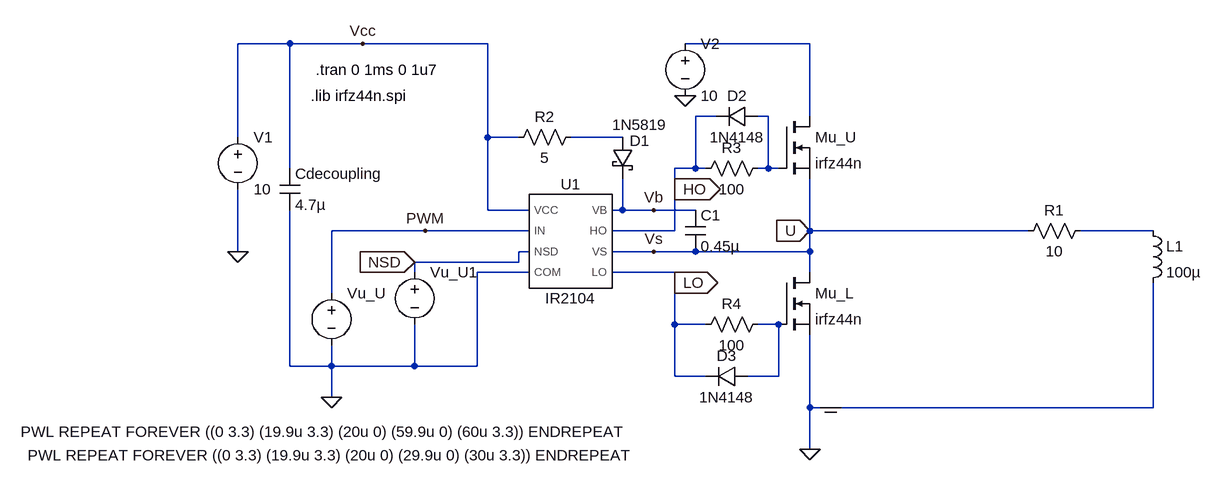
[diagram p0: schematic single_bldc_driver.asc]
single_bldc_driver.asc, the LTspice schematic file:
Version 4
SHEET 1 2100 1880
WIRE -1200 -608 -1280 -608
WIRE -1088 -608 -1200 -608
WIRE -896 -608 -1088 -608
WIRE -400 -608 -592 -608
WIRE -544 -496 -576 -496
WIRE -464 -496 -480 -496
WIRE -400 -496 -400 -608
WIRE -1280 -464 -1280 -608
WIRE -896 -464 -896 -608
WIRE -848 -464 -896 -464
WIRE -688 -464 -768 -464
WIRE -1200 -416 -1200 -608
WIRE -576 -416 -576 -496
WIRE -576 -416 -608 -416
WIRE -560 -416 -576 -416
WIRE -464 -416 -464 -496
WIRE -464 -416 -480 -416
WIRE -448 -416 -464 -416
WIRE -608 -384 -608 -416
WIRE -896 -352 -896 -464
WIRE -832 -352 -896 -352
WIRE -688 -352 -688 -400
WIRE -688 -352 -704 -352
WIRE -640 -352 -688 -352
WIRE -576 -352 -640 -352
WIRE -992 -320 -1136 -320
WIRE -832 -320 -992 -320
WIRE -608 -320 -608 -384
WIRE -608 -320 -704 -320
WIRE -400 -320 -400 -400
WIRE -64 -320 -400 -320
WIRE 128 -320 16 -320
WIRE -1280 -288 -1280 -384
WIRE -832 -288 -848 -288
WIRE -640 -288 -704 -288
WIRE -576 -288 -640 -288
WIRE -400 -288 -400 -320
WIRE -400 -288 -576 -288
WIRE -848 -272 -848 -288
WIRE -848 -272 -1008 -272
WIRE -1008 -256 -1008 -272
WIRE -832 -256 -912 -256
WIRE -608 -256 -704 -256
WIRE -400 -256 -400 -288
WIRE -608 -240 -608 -256
WIRE -1136 -224 -1136 -320
WIRE -608 -176 -608 -240
WIRE -560 -176 -608 -176
WIRE -448 -176 -480 -176
WIRE -1200 -112 -1200 -352
WIRE -1136 -112 -1136 -144
WIRE -1136 -112 -1200 -112
WIRE -1008 -112 -1008 -176
WIRE -1008 -112 -1136 -112
WIRE -912 -112 -912 -256
WIRE -912 -112 -1008 -112
WIRE -608 -96 -608 -176
WIRE -560 -96 -608 -96
WIRE -448 -96 -448 -176
WIRE -448 -96 -496 -96
WIRE -1136 -64 -1136 -112
WIRE -400 -48 -400 -160
WIRE -368 -48 -400 -48
WIRE 128 -48 128 -240
WIRE 128 -48 -368 -48
WIRE -400 16 -400 -48
FLAG -1136 -64 0
FLAG -400 16 0
FLAG -1280 -288 0
FLAG -1008 -272 NSD
IOPIN -1008 -272 In
FLAG -640 -288 Vs
FLAG -640 -352 Vb
FLAG -608 -384 HO
IOPIN -608 -384 Out
FLAG -608 -240 LO
IOPIN -608 -240 Out
FLAG -400 -320 U
IOPIN -400 -320 In
FLAG -368 -48 COM
FLAG -1088 -608 Vcc
FLAG -592 -528 0
FLAG -992 -320 PWM
DATAFLAG -400 -48 ""
SYMBOL nmos -448 -256 R0
SYMATTR InstName Mu_L
SYMATTR Value irfz44n
SYMATTR Prefix X
SYMBOL nmos -448 -496 R0
SYMATTR InstName Mu_U
SYMATTR Value irfz44n
SYMATTR Prefix X
SYMBOL voltage -1136 -240 R0
WINDOW 3 -478 229 Left 2
SYMATTR Value PWL REPEAT FOREVER ((0 3.3) (19.9u 3.3) (20u 0) (59.9u 0) (60u 3.3)) ENDREPEAT
SYMATTR InstName Vu_U
SYMBOL AutoGenerated\\IR2104 -768 -304 R0
SYMATTR InstName U1
SYMBOL voltage -1280 -480 R0
WINDOW 123 0 0 Left 0
WINDOW 39 0 0 Left 0
SYMATTR InstName V1
SYMATTR Value 10
SYMBOL schottky -704 -464 R0
WINDOW 0 27 5 Left 2
WINDOW 3 0 -19 Left 2
SYMATTR InstName D1
SYMATTR Value 1N5819
SYMATTR Description Diode
SYMATTR Type diode
SYMBOL cap -592 -352 R0
SYMATTR InstName C1
SYMATTR Value 0.45µ
SYMBOL voltage -1008 -272 R0
WINDOW 3 -595 297 Left 2
SYMATTR Value PWL REPEAT FOREVER ((0 3.3) (19.9u 3.3) (20u 0) (29.9u 0) (30u 3.3)) ENDREPEAT
SYMATTR InstName Vu_U1
SYMBOL res 32 -336 R90
WINDOW 0 0 56 VBottom 2
WINDOW 3 32 56 VTop 2
SYMATTR InstName R1
SYMATTR Value 10
SYMBOL voltage -592 -624 R0
WINDOW 123 0 0 Left 0
WINDOW 39 0 0 Left 0
SYMATTR InstName V2
SYMATTR Value 10
SYMBOL res -752 -480 R90
WINDOW 0 0 56 VBottom 2
WINDOW 3 32 56 VTop 2
SYMATTR InstName R2
SYMATTR Value 5
SYMBOL res -464 -432 R90
WINDOW 0 0 56 VBottom 2
WINDOW 3 32 56 VTop 2
SYMATTR InstName R3
SYMATTR Value 100
SYMBOL res -464 -192 R90
WINDOW 0 0 56 VBottom 2
WINDOW 3 32 56 VTop 2
SYMATTR InstName R4
SYMATTR Value 100
SYMBOL ind 112 -336 R0
SYMATTR InstName L1
SYMATTR Value 100µ
SYMBOL cap -1216 -416 R0
SYMATTR InstName Cdecoupling
SYMATTR Value 4.7µ
SYMBOL diode -480 -512 R90
WINDOW 0 0 32 VBottom 2
WINDOW 3 32 32 VTop 2
SYMATTR InstName D2
SYMATTR Value 1N4148
SYMBOL diode -496 -112 R90
WINDOW 0 0 32 VBottom 2
WINDOW 3 32 32 VTop 2
SYMATTR InstName D3
SYMATTR Value 1N4148
TEXT -1160 -568 Left 2 !.tran 0 1ms 0 1u7
TEXT -1168 -528 Left 2 !.lib irfz44n.spi

The netlist it stands for:
* single_bldc_driver.asc
XMu_L U N005 0 irfz44n  ; pins D G S
XMu_U N001 N002 U irfz44n  ; pins D G S
Vu_U PWM 0 PWL REPEAT FOREVER ((0 3.3) (19.9u 3.3) (20u 0) (59.9u 0) (60u 3.3)) ENDREPEAT
XU1 LO HO 0 PWM Vcc Vb U NSD IR2104  ; pins LO HO COM IN VCC VB VS NSD
V1 Vcc 0 10
D1 N003 Vb 1N5819
C1 Vb U 0.45µ
Vu_U1 NSD 0 PWL REPEAT FOREVER ((0 3.3) (19.9u 3.3) (20u 0) (29.9u 0) (30u 3.3)) ENDREPEAT
R1 N004 U 10
V2 N001 0 10
R2 N003 Vcc 5
R3 N002 HO 100
R4 N005 LO 100
L1 N004 0 100µ
Cdecoupling Vcc 0 4.7µ
D2 N002 HO 1N4148
D3 N005 LO 1N4148
.model D D
.lib standard.dio
.tran 0 1ms 0 1u7
.lib irfz44n.spi
.lib C:\users\iwolfs\My Documents\LTspiceXVII\lib\other\IR2104\Model\IR2104.lib
.backanno
.end